# EAGLE design main (EAGLE 7.5.0)
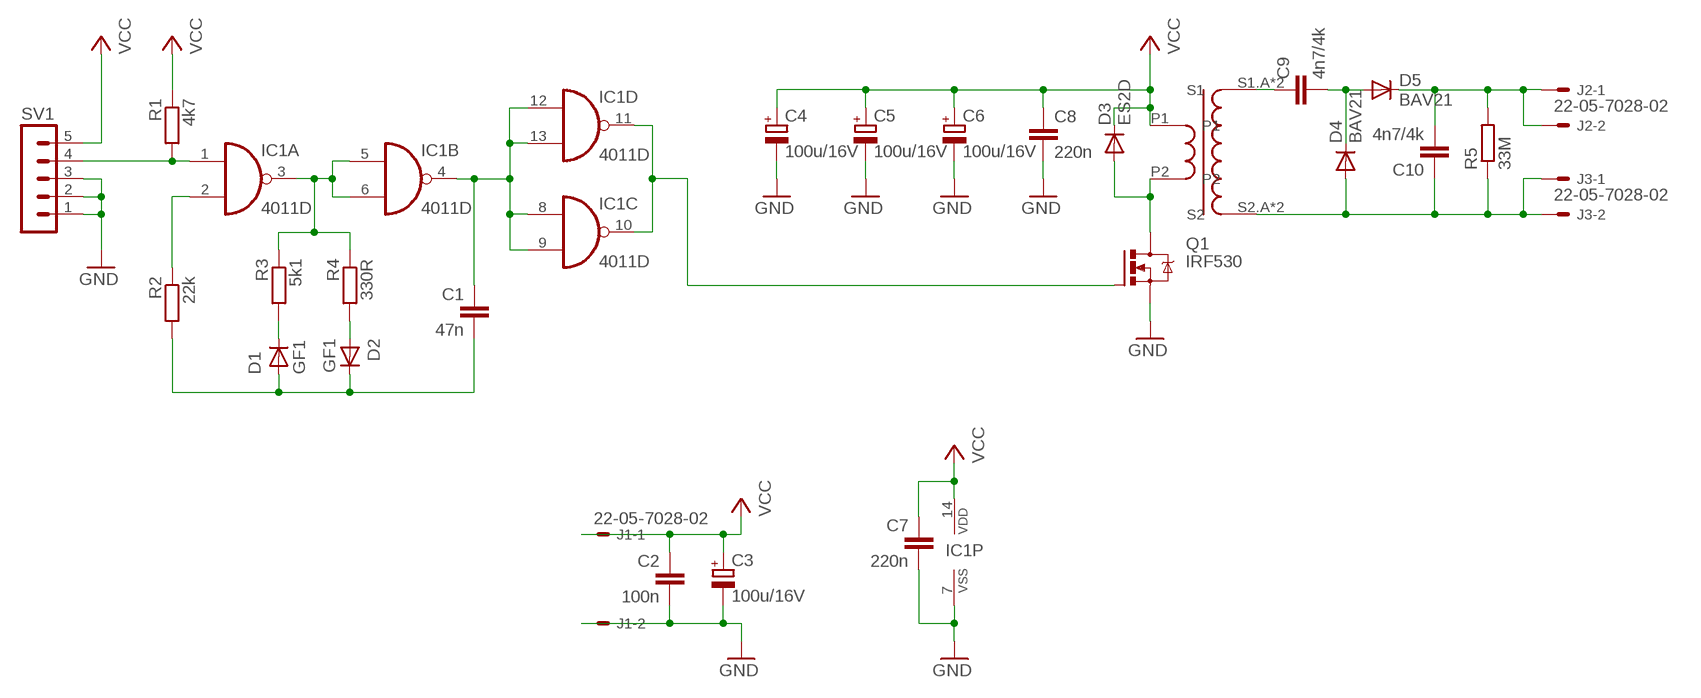
[diagram p0: schematic, sheet 1]

## Parts
11  CCFL_INVERTER_COIL  [CCFL_INVERTER_COIL]
C1  47n  C-EU025-025X050  [C025-025X050]
C2  100n  C-EUC0805  [C0805]
C3  100u/16V  CPOL-EU153CLV-0505  [153CLV-0505]
C4  100u/16V  CPOL-EU153CLV-0505  [153CLV-0505]
C5  100u/16V  CPOL-EU153CLV-0505  [153CLV-0505]
C6  100u/16V  CPOL-EU153CLV-0505  [153CLV-0505]
C7  220n  C-EUC0805  [C0805]
C8  220n  C-EUC0805  [C0805]
C9  4n7/4k  C-EU075-042X103  [C075-042X103]
C10  4n7/4k  C-EU075-042X103  [C075-042X103]
D1  GF1  [SMA-DO214AC]
D2  GF1  [SMA-DO214AC]
D3  ES2D  [SMB]
D4  BAV21  [DO35-10]
D5  BAV21  [DO35-10]
IC1  4011D  [SO14]
J1  22-05-7028-02  [7395-02]
J2  22-05-7028-02  [7395-02]
J3  22-05-7028-02  [7395-02]
Q1  IRF530  [TO220BV]
R1  4k7  R-EU_M0805  [M0805]
R2  22k  R-EU_M0805  [M0805]
R3  5k1  R-EU_M0805  [M0805]
R4  330R  R-EU_M0805  [M0805]
R5  33M  R-EU_0207/10  [0207/10]
SV1  MA05-1  [MA05-1]

## Nets
GND: C2.2 C3.- C4.- C5.- C6.- C7.2 C8.2 IC1.7(P:VSS) J1.2 Q1.S SV1.1 SV1.2 SV1.3
N$1: IC1.2(A:I1) R2.1
N$2: IC1.1(A:I0) R1.2 SV1.4
N$3: 11.P2 D3.A Q1.D
N$4: IC1.10(C:O) IC1.11(D:O) Q1.G
N$5: C1.1 IC1.4(B:O) IC1.8(C:I0) IC1.9(C:I1) IC1.12(D:I0) IC1.13(D:I1)
N$6 [high_voltage]: 11.S1.A(S1) 11.S1.B(S1) C9.1
N$7 [high_voltage]: C9.2 D4.C D5.A
N$10 [high_voltage]: C10.2 D5.C J2.1 J2.2 R5.2
N$11 [high_voltage]: 11.S2.A(S2) 11.S2.B(S2) C10.1 D4.A J3.1 J3.2 R5.1
N$22: IC1.3(A:O) IC1.5(B:I0) IC1.6(B:I1) R3.1 R4.1
N$23: C1.2 D1.A D2.K(C) R2.2
N$24: D1.K(C) R3.2
N$25: D2.A R4.2
VCC: 11.P1 C2.1 C3.+ C4.+ C5.+ C6.+ C7.1 C8.1 D3.C IC1.14(P:VDD) J1.1 R1.1 SV1.5

## Library data of the parts
11 = ccfl_inverter_coil:CCFL_INVERTER_COIL: CCFL inverter coil.
C1 C2 C7 C8 C10 = resistor:C-EU: CAPACITOR, European symbol
C3 C4 C6 = rcl:CPOL-EU: POLARIZED CAPACITOR, European symbol
C5 = resistor:CPOL-EU: POLARIZED CAPACITOR, European symbol
C9 = rcl:C-EU: CAPACITOR, European symbol
D1 D2 = diode:GF1: DIODE
D3 = diode:ES2D: DIODE super fast rectifier, 2 A
D4 D5 = diode:BAV21: DIODE high-voltage general purpose diode
IC1 = 40xx:4011: Quad 2-input NAND
J1-J3 = con-molex:22-?-02: CONNECTOR wire to board 2.54 mm (.1 inch) pitch header; OC_FARNELL: 9731601; OC_NEWARK: unknown
Q1 = transistor-power:IRF530: HEXFET Power MOSFET
R1-R5 = resistor:R-EU_: RESISTOR, European symbol
SV1 = con-lstb:MA05-1: PIN HEADER; OC_FARNELL: unknown; OC_NEWARK: unknown

## Net classes
0 signal: width 0.559 mm, drill 0.254 mm, clearance 0.254 mm
1 high_voltage: width 8.915 mm, clearance 0.889 mm
2 power_supply: width 0.559 mm

## Board
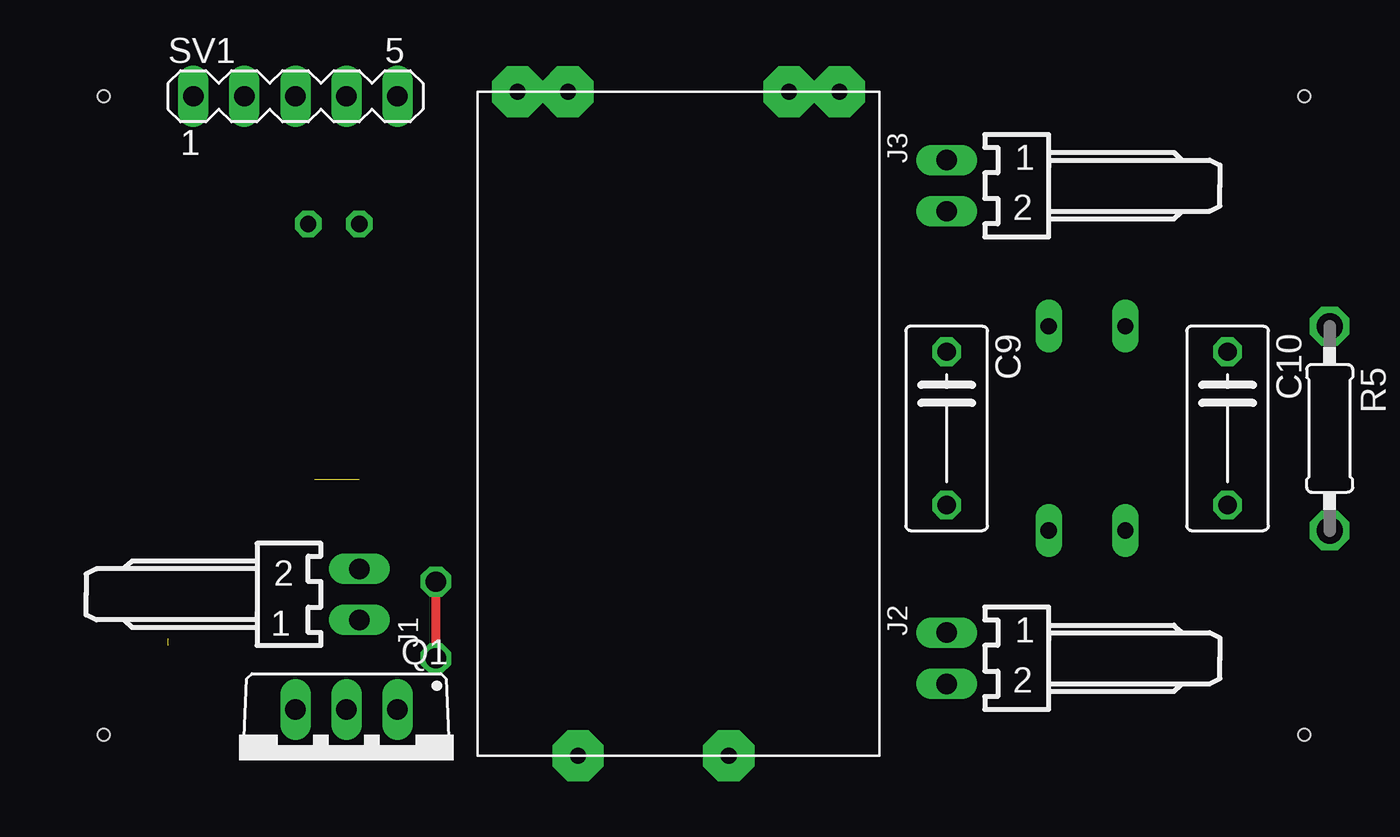
[diagram p1: board, top side]
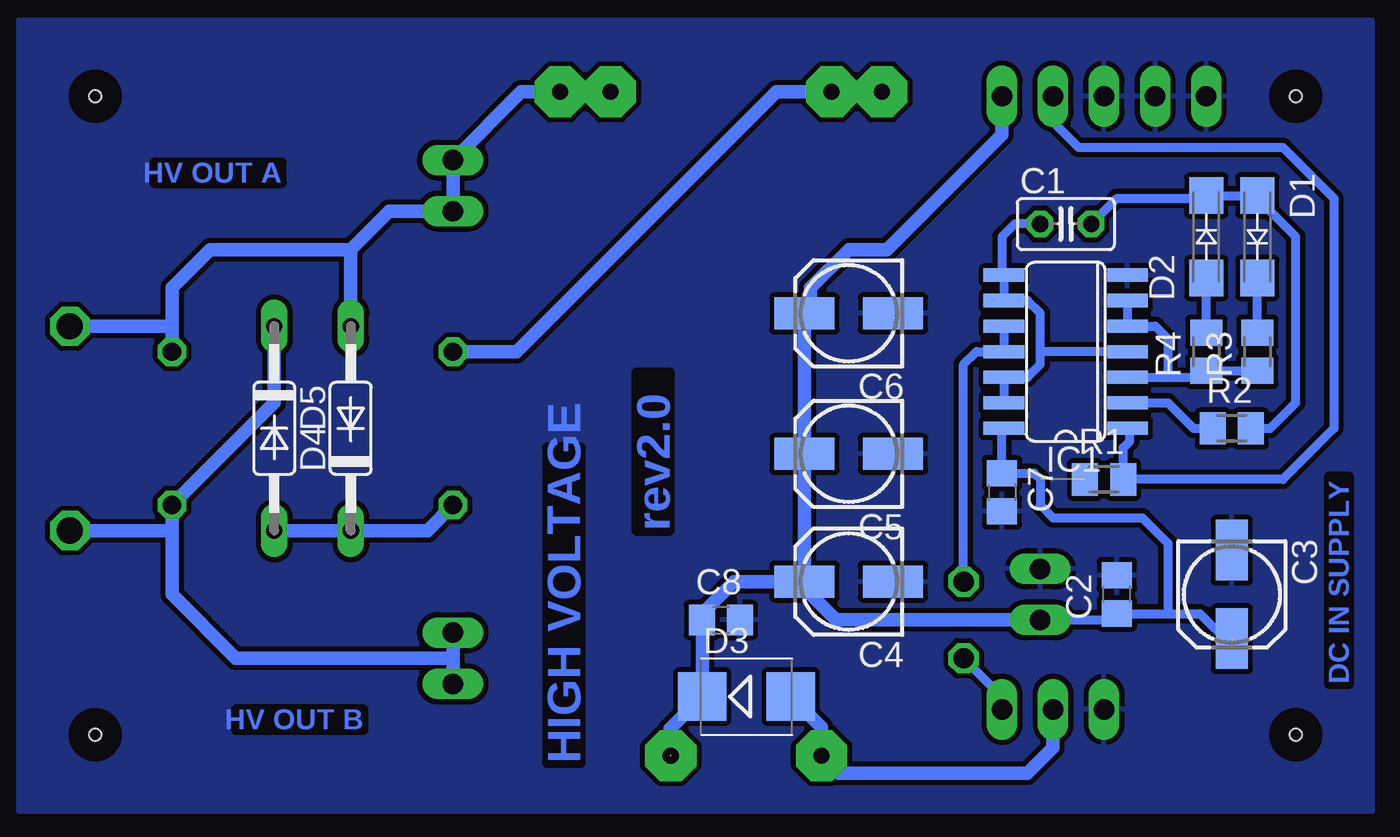
[diagram p2: board, bottom side, seen from below]

No outline drawn. Coordinates in mm, seen from the top.
Copper layers (1*16): Top 0.035mm / dielectric 1.5mm / Bottom 0.035mm
Design rules "default *": minimum track width 10mil, minimum drill 24mil, track to track 10mil, track to pad 10mil, pad to pad 8mil, via to via 8mil, smd to smd 8mil, copper to edge 40mil, drill to drill 8mil, minimum pad ring 10mil, minimum via ring 8mil, stop-mask expansion 4mil, vias tented up to drill 0mil, thermal gap 10mil
Holes 0.6 mm at 3.81,35.56 3.81,3.81 63.5,35.56 63.5,3.81

### Footprints (pad centres in the part's own frame; a part is rotated, then mirrored left to right if it is on the bottom)
CCFL_INVERTER_COIL = drill 0.8 pad 2.54 octagon: P1 2.5,-15; P2 -5,-15; S1.A -8,18; S1.B -5.5,18; S2.A 5.5,18; S2.B 8,18
C025-025X050 = drill 0.813 octagon: 1 -1.27,0; 2 1.27,0
C0805 = smd 1.3 x 1.5: 1 -0.95,0; 2 0.95,0
153CLV-0505 = smd 3 x 1.6: + 2.2,0; - -2.2,0
C075-042X103 = drill 0.914 octagon: 1 -3.81,0; 2 3.81,0
SMA-DO214AC = smd 1.8 x 1.7: A -2.05,0; K 2.05,0
SMB = smd 2.4 x 2.4: A 2.2,0; C -2.2,0
DO35-10 = drill 0.813 long: A 5.08,0; C -5.08,0
SO14 = smd 0.66 x 2.032: 1 -3.81,-3.073; 2 -2.54,-3.073; 3 -1.27,-3.073; 4 0,-3.073; 5 1.27,-3.073; 6 2.54,-3.073; 7 3.81,-3.073; 8 3.81,3.073; 9 2.54,3.073; 10 1.27,3.073; 11 0,3.073; 12 -1.27,3.073; 13 -2.54,3.073; 14 -3.81,3.073
7395-02 = drill 1.016 long: 1 1.27,0; 2 -1.27,0
TO220BV = drill 1.016 long: D 0,-2.54; G -2.54,-2.54; S 2.54,-2.54
M0805 = smd 1.3 x 1.6: 1 -0.95,0; 2 0.95,0
0207/10 = drill 1.3 octagon: 1 -5.08,0; 2 5.08,0
MA05-1 = drill 1.016 long: 1 -5.08,0; 2 -2.54,0; 3 0,0; 4 2.54,0; 5 5.08,0

### Placement (x,y rotation side)
11  32.38,17.78 0 top
C1  15.24,29.21 0 bottom
C2  12.7,10.79 90 bottom
C3  6.99,10.79 270 bottom
C4  26.04,11.43 180 bottom
C5  26.04,17.78 180 bottom
C6  26.04,24.77 180 bottom
C7  18.41,15.88 270 bottom
C8  32.38,9.53 0 bottom
C9  45.72,19.05 270 top
C10  59.69,19.05 270 top
D1  5.71,28.57 270 bottom
D2  8.26,28.57 90 bottom
D3  31.11,5.71 0 bottom
D4  50.8,19.05 90 bottom
D5  54.61,19.05 270 bottom
IC1  15.24,22.86 90 bottom
J1  16.51,10.79 270 top
J2  45.72,7.62 90 top
J3  45.72,31.11 90 top
Q1  15.88,2.54 180 top
R1  13.34,16.51 0 bottom
R2  6.99,19.05 0 bottom
R3  5.71,22.86 90 bottom
R4  8.26,22.86 90 bottom
R5  64.77,19.05 270 top
SV1  13.34,35.56 0 top

### Tracks (layer width: path | path; a pad name or v marks a point on that pad's centre or on a via)
GND
  pour Bottom: 0,39.37 0,0 67.31,0 67.31,39.37
N$1
  Bottom 0.457: IC1.2 10.16,20.32 8.89,19.05 R2.1
N$2
  Bottom 0.457: SV1.4 15.88,34.29 14.61,33.02 4.45,33.02 1.91,30.48 1.91,19.05 4.45,16.51 R1.2 12.38,18.09 12.06,18.41 12.06,18.95 IC1.1
N$3
  Bottom 0.66: 11.P2 27.39,4.18 D3.A | Q1.D 15.88,3.17 17.14,1.91 26.51,1.91 11.P2 | 27.14,2.54 11.P2
N$4  (via drill 1)
  Top 0.457: v20.32,7.62 v20.32,11.43
  Bottom 0.457: IC1.10 IC1.11 19.68,22.86 20.32,22.23 v20.32,11.43 | Q1.G 18.41,5.71 v20.32,7.62
N$5
  Bottom 0.457: IC1.13 IC1.12 17.14,21.59 16.51,22.23 16.51,22.86 | 16.51,22.86 16.51,24.77 17.14,25.4 IC1.9 IC1.8 18.41,26.77 18.41,28.57 17.78,29.21 C1.1 | IC1.4 16.51,22.86
N$6
  Bottom 0.66: 11.S1.A 11.S1.B 29.62,35.78 42.55,22.86 C9.1
N$7
  Bottom 0.66: C9.2 46.99,13.97 D4.C D5.A
N$10
  Bottom 0.66: J2.1 45.72,7.62 | 45.72,7.62 J2.2 | D5.C 54.61,20.32 C10.2 | R5.2 59.69,13.97 C10.2 | C10.2 59.69,10.79 56.52,7.62 45.72,7.62
N$11
  Bottom 0.66: 11.S2.A 11.S2.B 42.33,35.78 J3.1 J3.2 48.9,29.84 50.8,27.94 | 50.8,27.94 D4.A | R5.1 59.69,24.13 | C10.1 59.69,24.13 | 59.69,24.13 59.69,26.04 57.78,27.94 50.8,27.94
N$22
  Bottom 0.457: IC1.6 IC1.5 10.79,24.13 10.16,23.5 10.16,21.59 | IC1.3 10.16,21.59 | 10.16,21.59 8.57,21.59 R4.1 R3.1
N$23
  Bottom 0.457: R2.2 5.08,19.05 3.81,20.32 3.81,28.57 5.71,30.48 D1.A D2.K 8.4,30.48 12.7,30.48 C1.2
N$24
  Bottom 0.457: R3.2 D1.K
N$25
  Bottom 0.457: R4.2 D2.A
VCC  (3 unrouted)
  Bottom 0.457: 18.41,18.95 C7.1 16.82,16.82 16.51,16.51 16.51,15.24 15.88,14.61 11.43,14.61 10.16,13.34 10.16,9.85 | J1.1 13.02,9.53 C2.1 10.16,9.85 | 7.28,8.89 C3.+ | 10.16,9.85 8.57,9.85 6.99,8.26
  Bottom 0.66: 34.92,2.82 34.92,4.11 D3.C 33.31,9.5 | 33.31,9.5 C8.1 | 33.31,9.5 33.31,9.87 31.75,11.43 C4.+ C5.+ | C5.+ C6.+ 27.94,25.06 27.94,26.04 26.04,27.94 24.13,27.94 18.41,33.66 SV1.5 | 18.41,18.95 IC1.14 | C5.+ 28.23,11.72 27.94,11.43 27.94,10.79 26.67,9.53 J1.1

### Text on the board
Bottom: HV OUT A | rev2.0 | DC IN SUPPLY | HV OUT B | HIGH VOLTAGE